# Altium schematic sheet power_eagle_1.SchDoc
size 415 x 251 mm
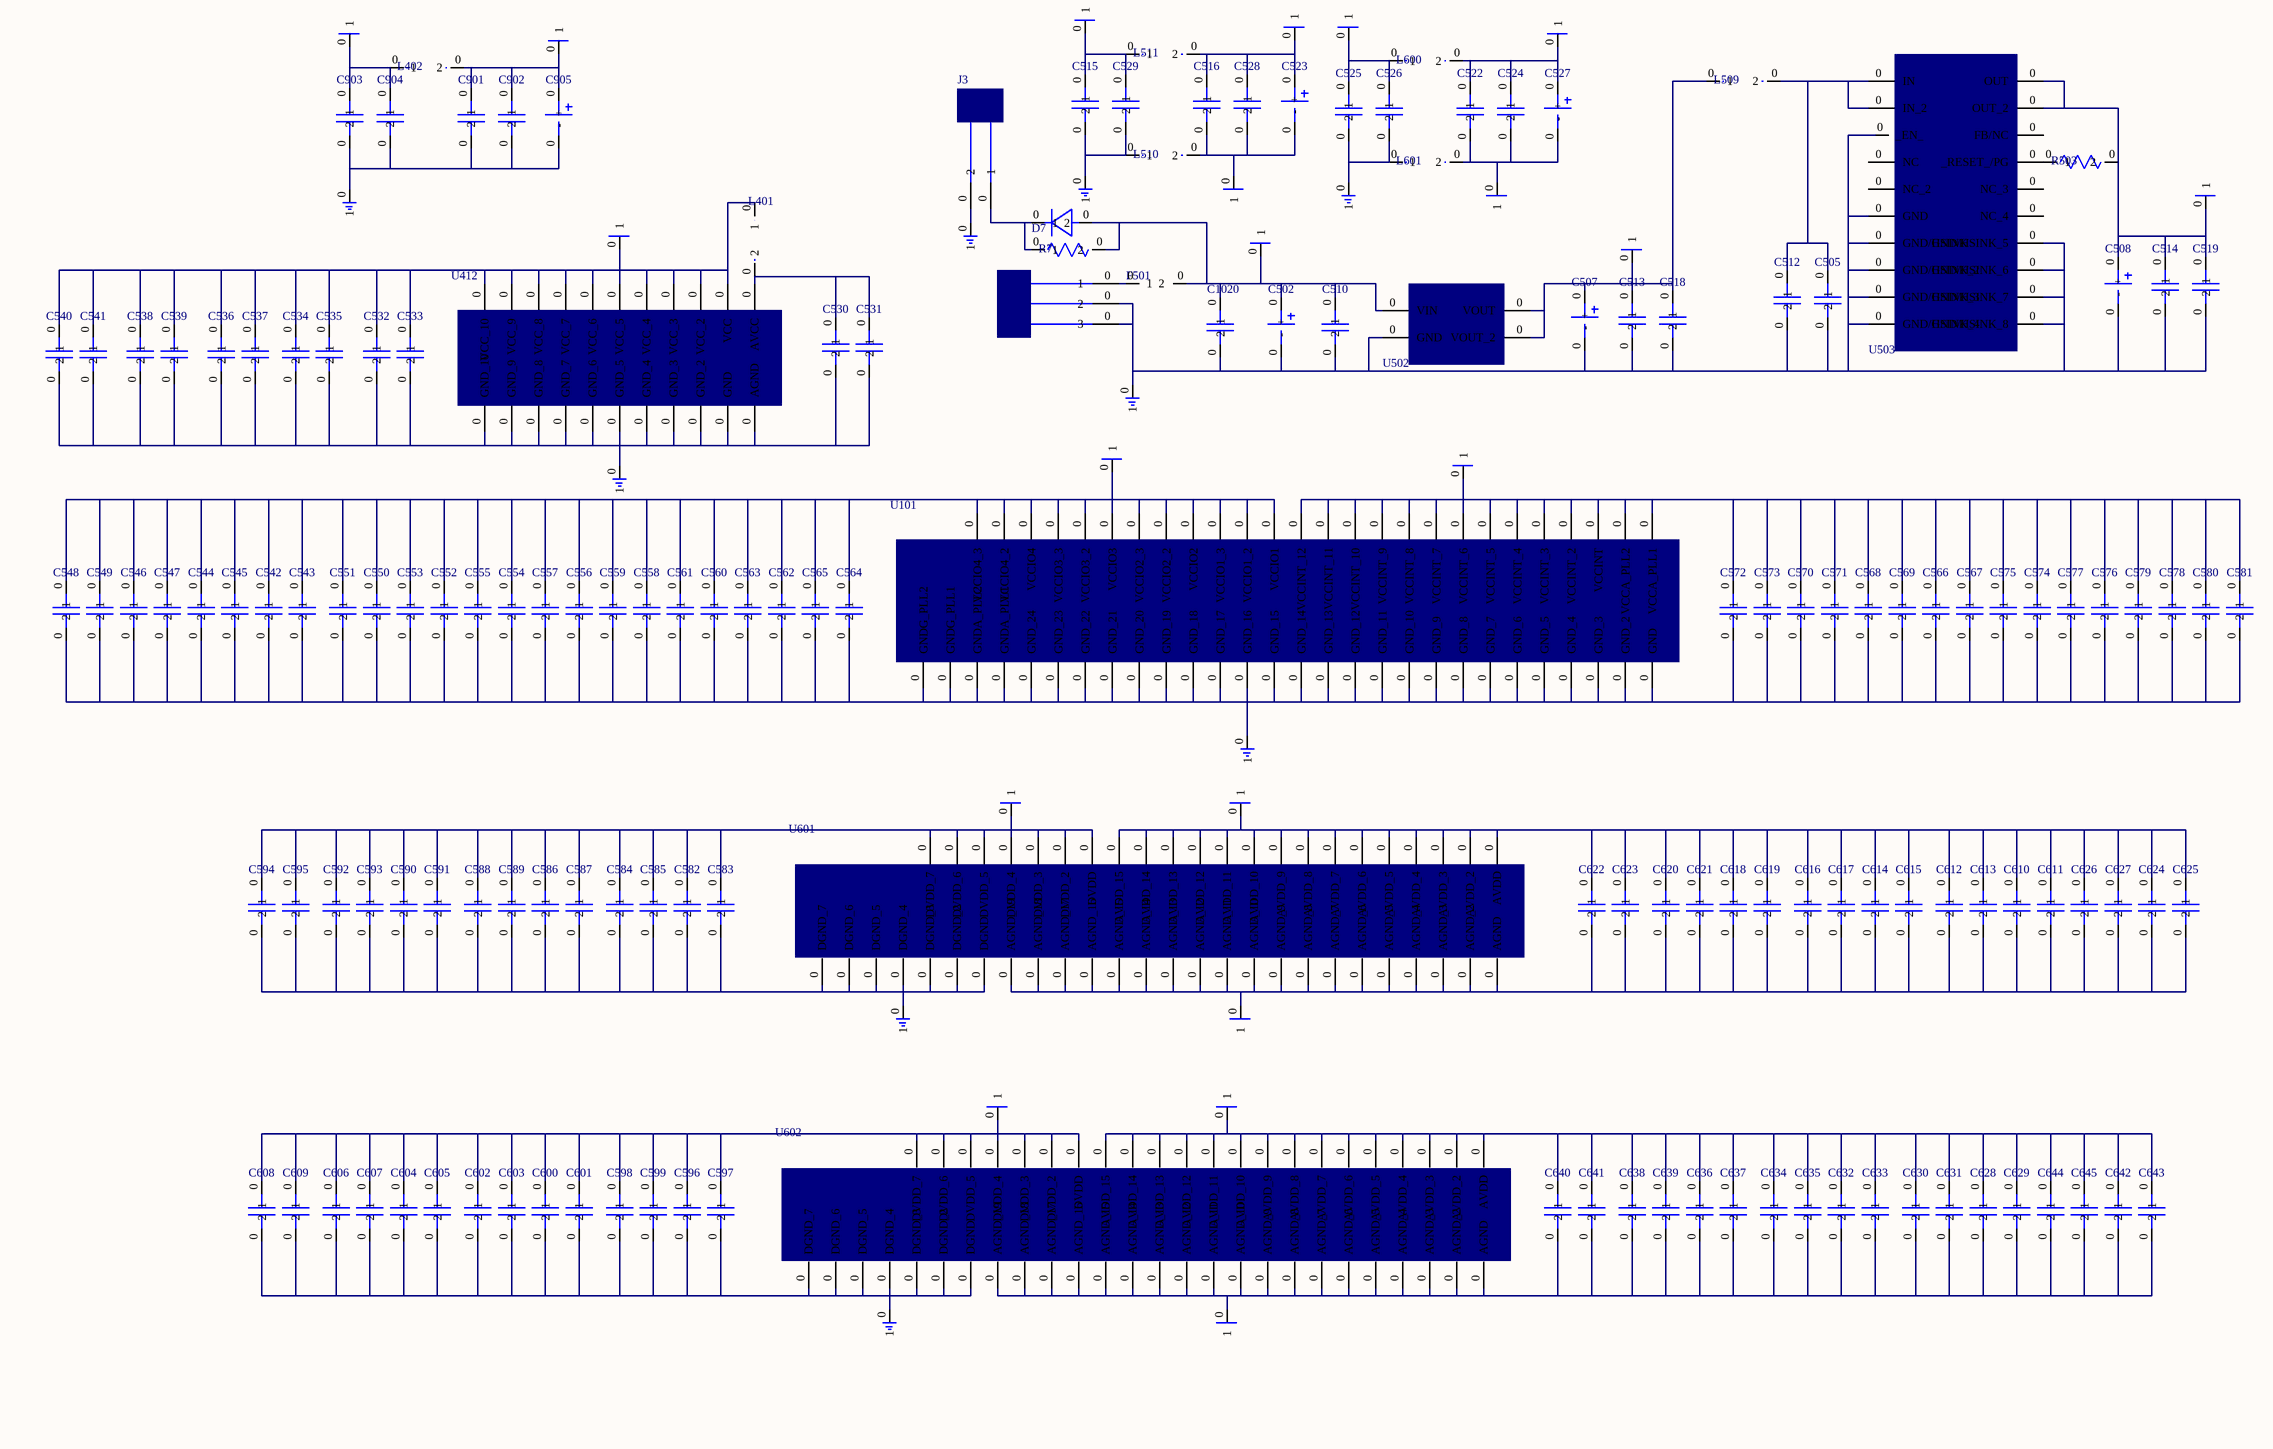
[diagram p0: power_eagle_1.SchDoc]

## Parts
C502  (no value)
C505  (no value)
C507  (no value)
C508  (no value)
C510  (no value)
C512  (no value)
C513  (no value)
C514  (no value)
C515  (no value)
C516  (no value)
C518  (no value)
C519  (no value)
C522  (no value)
C523  (no value)
C524  (no value)
C525  (no value)
C526  (no value)
C527  (no value)
C528  (no value)
C529  (no value)
C530  (no value)
C531  (no value)
C532  (no value)
C533  (no value)
C534  (no value)
C535  (no value)
C536  (no value)
C537  (no value)
C538  (no value)
C539  (no value)
C540  (no value)
C541  (no value)
C542  (no value)
C543  (no value)
C544  (no value)
C545  (no value)
C546  (no value)
C547  (no value)
C548  (no value)
C549  (no value)
C550  (no value)
C551  (no value)
C552  (no value)
C553  (no value)
C554  (no value)
C555  (no value)
C556  (no value)
C557  (no value)
C558  (no value)
C559  (no value)
C560  (no value)
C561  (no value)
C562  (no value)
C563  (no value)
C564  (no value)
C565  (no value)
C566  (no value)
C567  (no value)
C568  (no value)
C569  (no value)
C570  (no value)
C571  (no value)
C572  (no value)
C573  (no value)
C574  (no value)
C575  (no value)
C576  (no value)
C577  (no value)
C578  (no value)
C579  (no value)
C580  (no value)
C581  (no value)
C582  (no value)
C583  (no value)
C584  (no value)
C585  (no value)
C586  (no value)
C587  (no value)
C588  (no value)
C589  (no value)
C590  (no value)
C591  (no value)
C592  (no value)
C593  (no value)
C594  (no value)
C595  (no value)
C596  (no value)
C597  (no value)
C598  (no value)
C599  (no value)
C600  (no value)
C601  (no value)
C602  (no value)
C603  (no value)
C604  (no value)
C605  (no value)
C606  (no value)
C607  (no value)
C608  (no value)
C609  (no value)
C610  (no value)
C611  (no value)
C612  (no value)
C613  (no value)
C614  (no value)
C615  (no value)
C616  (no value)
C617  (no value)
C618  (no value)
C619  (no value)
C620  (no value)
C621  (no value)
C622  (no value)
C623  (no value)
C624  (no value)
C625  (no value)
C626  (no value)
C627  (no value)
C628  (no value)
C629  (no value)
C630  (no value)
C631  (no value)
C632  (no value)
C633  (no value)
C634  (no value)
C635  (no value)
C636  (no value)
C637  (no value)
C638  (no value)
C639  (no value)
C640  (no value)
C641  (no value)
C642  (no value)
C643  (no value)
C644  (no value)
C645  (no value)
C901  (no value)
C902  (no value)
C903  (no value)
C904  (no value)
C905  (no value)
C1020  (no value)
D7  (no value)
F501  (no value)
GENERIC-POWER  (no value)
GENERIC-POWER-0  (no value)
GENERIC-POWER-1  (no value)
GENERIC-POWER-2  (no value)
GENERIC-POWER-3  (no value)
GENERIC-POWER-4  (no value)
GENERIC-POWER-6  (no value)
GENERIC-POWER-7  (no value)
GENERIC-POWER-8  (no value)
GENERIC-POWER-11  (no value)
GENERIC-POWER-12  (no value)
GENERIC-POWER-14  (no value)
GENERIC-POWER-16  (no value)
GENERIC-POWER-17  (no value)
GENERIC-POWER-18  (no value)
GENERIC-POWER-20  (no value)
GENERIC-POWER-21  (no value)
GENERIC-POWER-22  (no value)
GENERIC-POWER-23  (no value)
GENERIC-POWER-24  (no value)
GND-1  (no value)
GND-1-5  (no value)
GND-1-9  (no value)
GND-1-10  (no value)
GND-1-13  (no value)
GND-1-15  (no value)
GND-1-19  (no value)
GND-1-25  (no value)
GND-1-26  (no value)
J3  (no value)
J502  (no value)
L401  (no value)
L402  (no value)
L509  (no value)
L510  (no value)
L511  (no value)
L600  (no value)
L601  (no value)
R7  (no value)
R503  (no value)
U101  (no value)
U412  (no value)
U502  (no value)
U503  (no value)
U601  (no value)
U602  (no value)

## Nets
NetC502_0: C502.0(+) C510.0(1) C1020.0(1) D7.0(2) F501.0(2) GENERIC-POWER-0.0(1) R7.0(2) U502.0(VIN)
NetC502_0: C502.0(-) C505.0(2) C507.0(-) C508.0(-) C510.0(2) C512.0(2) C513.0(2) C514.0(2) C518.0(2) C519.0(2) C1020.0(2) GND-1.0(1) J502.0(2) U502.0(GND) U503.0(FB/NC)  [a separate net that carries the same name]
NetC505_0: C505.0(1) C512.0(1) L509.0(2) U503.0(IN)
NetC507_0: C507.0(+) C513.0(1) C518.0(1) GENERIC-POWER-1.0(1) L509.0(1) U502.0(VOUT)
NetC508_0: C508.0(+) C514.0(1) C519.0(1) GENERIC-POWER.0(1) R503.0(2) U503.0(OUT)
NetC515_0: C515.0(1) C529.0(1) GENERIC-POWER-6.0(1) L511.0(1)
NetC515_0: C515.0(2) C529.0(2) GND-1-9.0(1) L510.0(1)  [a separate net that carries the same name]
NetC516_0: C516.0(1) C523.0(+) C528.0(1) GENERIC-POWER-7.0(1) L511.0(2)
NetC516_0: C516.0(2) C523.0(-) C528.0(2) GENERIC-POWER-8.0(1) L510.0(2)  [a separate net that carries the same name]
NetC522_0: C522.0(1) C524.0(1) C527.0(+) GENERIC-POWER-3.0(1) L600.0(2)
NetC522_0: C522.0(2) C524.0(2) C527.0(-) GENERIC-POWER-4.0(1) L601.0(2)  [a separate net that carries the same name]
NetC525_0: C525.0(1) C526.0(1) GENERIC-POWER-2.0(1) L600.0(1)
NetC525_0: C525.0(2) C526.0(2) GND-1-5.0(1) L601.0(1)  [a separate net that carries the same name]
NetC530_0: C530.0(1) C531.0(1) L401.0(2) U412.0(AVCC)
NetC530_0: C530.0(2) C531.0(2) C532.0(2) C533.0(2) C534.0(2) C535.0(2) C536.0(2) C537.0(2) C538.0(2) C539.0(2) C540.0(2) C541.0(2) GND-1-10.0(1) U412.0(AGND)  [a separate net that carries the same name]
NetC532_0: C532.0(1) C533.0(1) C534.0(1) C535.0(1) C536.0(1) C537.0(1) C538.0(1) C539.0(1) C540.0(1) C541.0(1) GENERIC-POWER-11.0(1) L401.0(1) U412.0(VCC)
NetC542_0: C542.0(1) C543.0(1) C544.0(1) C545.0(1) C546.0(1) C547.0(1) C548.0(1) C549.0(1) C550.0(1) C551.0(1) C552.0(1) C553.0(1) C554.0(1) C555.0(1) C556.0(1) C557.0(1) C558.0(1) C559.0(1) C560.0(1) C561.0(1) C562.0(1) C563.0(1) C564.0(1) C565.0(1) GENERIC-POWER-14.0(1) U101.0(VCCIO1)
NetC542_0: C542.0(2) C543.0(2) C544.0(2) C545.0(2) C546.0(2) C547.0(2) C548.0(2) C549.0(2) C550.0(2) C551.0(2) C552.0(2) C553.0(2) C554.0(2) C555.0(2) C556.0(2) C557.0(2) C558.0(2) C559.0(2) C560.0(2) C561.0(2) C562.0(2) C563.0(2) C564.0(2) C565.0(2) C566.0(2) C567.0(2) C568.0(2) C569.0(2) C570.0(2) C571.0(2) C572.0(2) C573.0(2) C574.0(2) C575.0(2) C576.0(2) C577.0(2) C578.0(2) C579.0(2) C580.0(2) C581.0(2) GND-1-13.0(1) U101.0(GND)  [a separate net that carries the same name]
NetC566_0: C566.0(1) C567.0(1) C568.0(1) C569.0(1) C570.0(1) C571.0(1) C572.0(1) C573.0(1) C574.0(1) C575.0(1) C576.0(1) C577.0(1) C578.0(1) C579.0(1) C580.0(1) C581.0(1) GENERIC-POWER-12.0(1) U101.0(VCCA_PLL1)
NetC582_0: C582.0(1) C583.0(1) C584.0(1) C585.0(1) C586.0(1) C587.0(1) C588.0(1) C589.0(1) C590.0(1) C591.0(1) C592.0(1) C593.0(1) C594.0(1) C595.0(1) GENERIC-POWER-17.0(1) U601.0(DVDD)
NetC582_0: C582.0(2) C583.0(2) C584.0(2) C585.0(2) C586.0(2) C587.0(2) C588.0(2) C589.0(2) C590.0(2) C591.0(2) C592.0(2) C593.0(2) C594.0(2) C595.0(2) GND-1-15.0(1) U601.0(DGND)  [a separate net that carries the same name]
NetC596_0: C596.0(1) C597.0(1) C598.0(1) C599.0(1) C600.0(1) C601.0(1) C602.0(1) C603.0(1) C604.0(1) C605.0(1) C606.0(1) C607.0(1) C608.0(1) C609.0(1) GENERIC-POWER-21.0(1) U602.0(DVDD)
NetC596_0: C596.0(2) C597.0(2) C598.0(2) C599.0(2) C600.0(2) C601.0(2) C602.0(2) C603.0(2) C604.0(2) C605.0(2) C606.0(2) C607.0(2) C608.0(2) C609.0(2) GND-1-19.0(1) U602.0(DGND)  [a separate net that carries the same name]
NetC610_0: C610.0(1) C611.0(1) C612.0(1) C613.0(1) C614.0(1) C615.0(1) C616.0(1) C617.0(1) C618.0(1) C619.0(1) C620.0(1) C621.0(1) C622.0(1) C623.0(1) C624.0(1) C625.0(1) C626.0(1) C627.0(1) GENERIC-POWER-16.0(1) U601.0(AVDD)
NetC610_0: C610.0(2) C611.0(2) C612.0(2) C613.0(2) C614.0(2) C615.0(2) C616.0(2) C617.0(2) C618.0(2) C619.0(2) C620.0(2) C621.0(2) C622.0(2) C623.0(2) C624.0(2) C625.0(2) C626.0(2) C627.0(2) GENERIC-POWER-18.0(1) U601.0(AGND)  [a separate net that carries the same name]
NetC628_0: C628.0(1) C629.0(1) C630.0(1) C631.0(1) C632.0(1) C633.0(1) C634.0(1) C635.0(1) C636.0(1) C637.0(1) C638.0(1) C639.0(1) C640.0(1) C641.0(1) C642.0(1) C643.0(1) C644.0(1) C645.0(1) GENERIC-POWER-20.0(1) U602.0(AVDD)
NetC628_0: C628.0(2) C629.0(2) C630.0(2) C631.0(2) C632.0(2) C633.0(2) C634.0(2) C635.0(2) C636.0(2) C637.0(2) C638.0(2) C639.0(2) C640.0(2) C641.0(2) C642.0(2) C643.0(2) C644.0(2) C645.0(2) GENERIC-POWER-22.0(1) U602.0(AGND)  [a separate net that carries the same name]
NetC901_0: C901.0(1) C902.0(1) C905.0(+) GENERIC-POWER-24.0(1) L402.0(2)
NetC901_0: C901.0(2) C902.0(2) C903.0(2) C904.0(2) C905.0(-) GND-1-25.0(1)  [a separate net that carries the same name]
NetC903_0: C903.0(1) C904.0(1) GENERIC-POWER-23.0(1) L402.0(1)
NetD7_0: D7.0(1) J3.0(1) R7.0(1)
NetF501_0: F501.0(1) J502.0(1)
NetGND-1-26_0: GND-1-26.0(1) J3.0(2)
NetR503_0: R503.0(1) U503.0(_RESET_/PG)

## Library data of the parts
C502 C507 C508 C523 C527 C905 = CAPACITOR-2
C505 C510 C512-C516 C518 C519 C522 C524-C526 C528-C645 C901-C904 C1020 = CAPACITOR-1
D7 = DIODE-3
F501 = FUSE-1
GENERIC-POWER GENERIC-POWER-0-GENERIC-POWER-4 GENERIC-POWER-6-GENERIC-POWER-8 GENERIC-POWER-11 GENERIC-POWER-12 GENERIC-POWER-14 GENERIC-POWER-16-GENERIC-POWER-18 GENERIC-POWER-20-GENERIC-POWER-24 = GENERIC-POWER
GND-1 GND-1-5 GND-1-9 GND-1-10 GND-1-13 GND-1-15 GND-1-19 GND-1-25 GND-1-26 = GND-1
J3 = CONNECTOR2-1
J502 = CONNECTOR3-1
L401 L402 L509-L511 L600 L601 = INDUCTOR-1
R7 R503 = RESISTOR-1
U101 = EP1C12-PQ240-PWR
U412 = CY7C68013-TQ100-PWR
U502 = LT1085
U503 = TPS777XX-PWP
U601 U602 = AD986X-PWR